# Altium schematic sheet Current Measurement.SchDoc
size A4; Author: Catalina Miranda Hernández; CompanyName: Power & Energy Conversion Laboratory; Address1: Vicuña Mackenna 4860; Address2: Macul, Santiago; Address3: Chile; DocumentNumber: 1; SheetNumber: 1; SheetTotal: 3
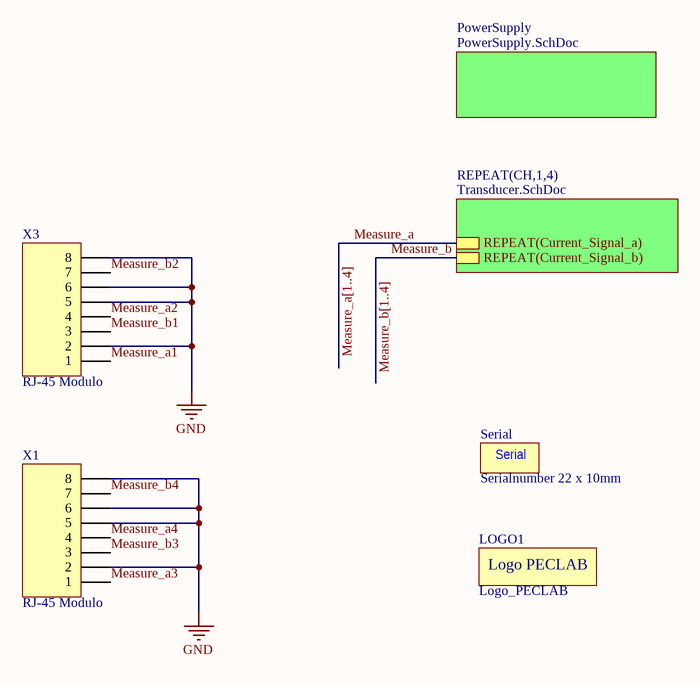
[diagram p0: Current Measurement.SchDoc]

## Parts
LOGO1  Logo_PECLAB  [Logo_PECLAB]
Serial  Serialnumber 22 x 10mm  [Serial_22x10mm]  (no BOM)
X1  RJ-45 Modulo  [RJ45_RJHSE5E80]
X3  RJ-45 Modulo  [RJ45_RJHSE5E80]

## Sub-sheets
PowerSupply = PowerSupply.SchDoc: no entries
REPEAT(CH,1,4) = Transducer.SchDoc: REPEAT(Current_Signal_a), REPEAT(Current_Signal_b)

## Nets
GND: X1.2 X1.5 X1.6 X1.8 X3.2 X3.5 X3.6 X3.8
Measure_a: sheet REPEAT(CH,1,4)/REPEAT(Current_Signal_a)
Measure_a1: X3.1
Measure_a2: X3.4
Measure_a3: X1.1
Measure_a4: X1.4
Measure_b: sheet REPEAT(CH,1,4)/REPEAT(Current_Signal_b)
Measure_b1: X3.3
Measure_b2: X3.7
Measure_b3: X1.3
Measure_b4: X1.7

## Buses and harness runs
bus Measure_a[1..4]
bus Measure_b[1..4]

## Notes on the sheet
- Title
- Size:
- Date:
- A4
- Revision:
- Time:
- Sheet
- of
- Author:
- Project:
- (in symbol Logo_PECLAB) Logo PECLAB

## Library data of the parts
Serial = SerialNumber: Created: 2020_07_12_DArancibia; Value: Serialnumber 22 x 10mm
X1 X3 = RJ45_RJHSE5E80: Modulo RJ-45 RJHSE5E80; Manufacturer Part-Number: 1-338088-3; Manufacturer: Amphenol Commercial; Shielding: Shielded; Connector Type: Jack; Number of Ports: 1; Direction: Up; Gender: Female; Current Rating: 1.5A; Voltage Rating: 125V; Number of Positions: 8; Insulation Resistance: 500MR; Pitch: 2.03mm; LatestRevisionDate: 17-Jul-2002; LatestRevisionNote: Re-released for DXP Platform.; Publisher: Altium Limited; Digikey Part-Number: A99306CT-ND; Supplier 1: Digi-Key; Manufacturer Part Number: RJHSE5E80; Stock 1: 16396; Pricing 1: 1=1.28, 10=1.125, 25=1.0584, 50=1.0144, 100=0.9702, 250=0.882, 500=0.7938, 1000=0.7056, 2500=0.63945 (USD); Mount: Through Hole; Contact Plating: Gold; Contact Material: Bronze; Housing Material: Thermoplastic; Color: Black; Min Operating Temperature: -55°C; Max Operating Temperature: 85°C; Packaging: Tray; Termination: Solder; Number of Rows: 1; Package Quantity: 120; Number of Contacts: 8; Orientation: Right Angle; Flammability Rating: UL94 V-0; ComponentLink1URL: http://www.mouser.com/ds/2/18/Amphenol_RJHSE_BRO-311217.pdf?src-supplier=Mouser; ComponentLink1Description: http://www.mouser.com/ds/2/18/Amphenol_RJHSE_BRO-311217.pdf?src-supplier=Mouser; ComponentLink2URL: https://media.digikey.com/pdf/Data%20Sheets/Amphenol%20PDFs/RJHSE5E8x_Dwg.pdf?src-supplier=Digi-Key; ComponentLink2Description: https://media.digikey.com/pdf/Data%20Sheets/Amphenol%20PDFs/RJHSE5E8x_Dwg.pdf?src-supplier=Digi-Key; Supplier Part Number 1: RJHSE5E80-ND